# EAGLE design input-device (EAGLE 9.6.2)
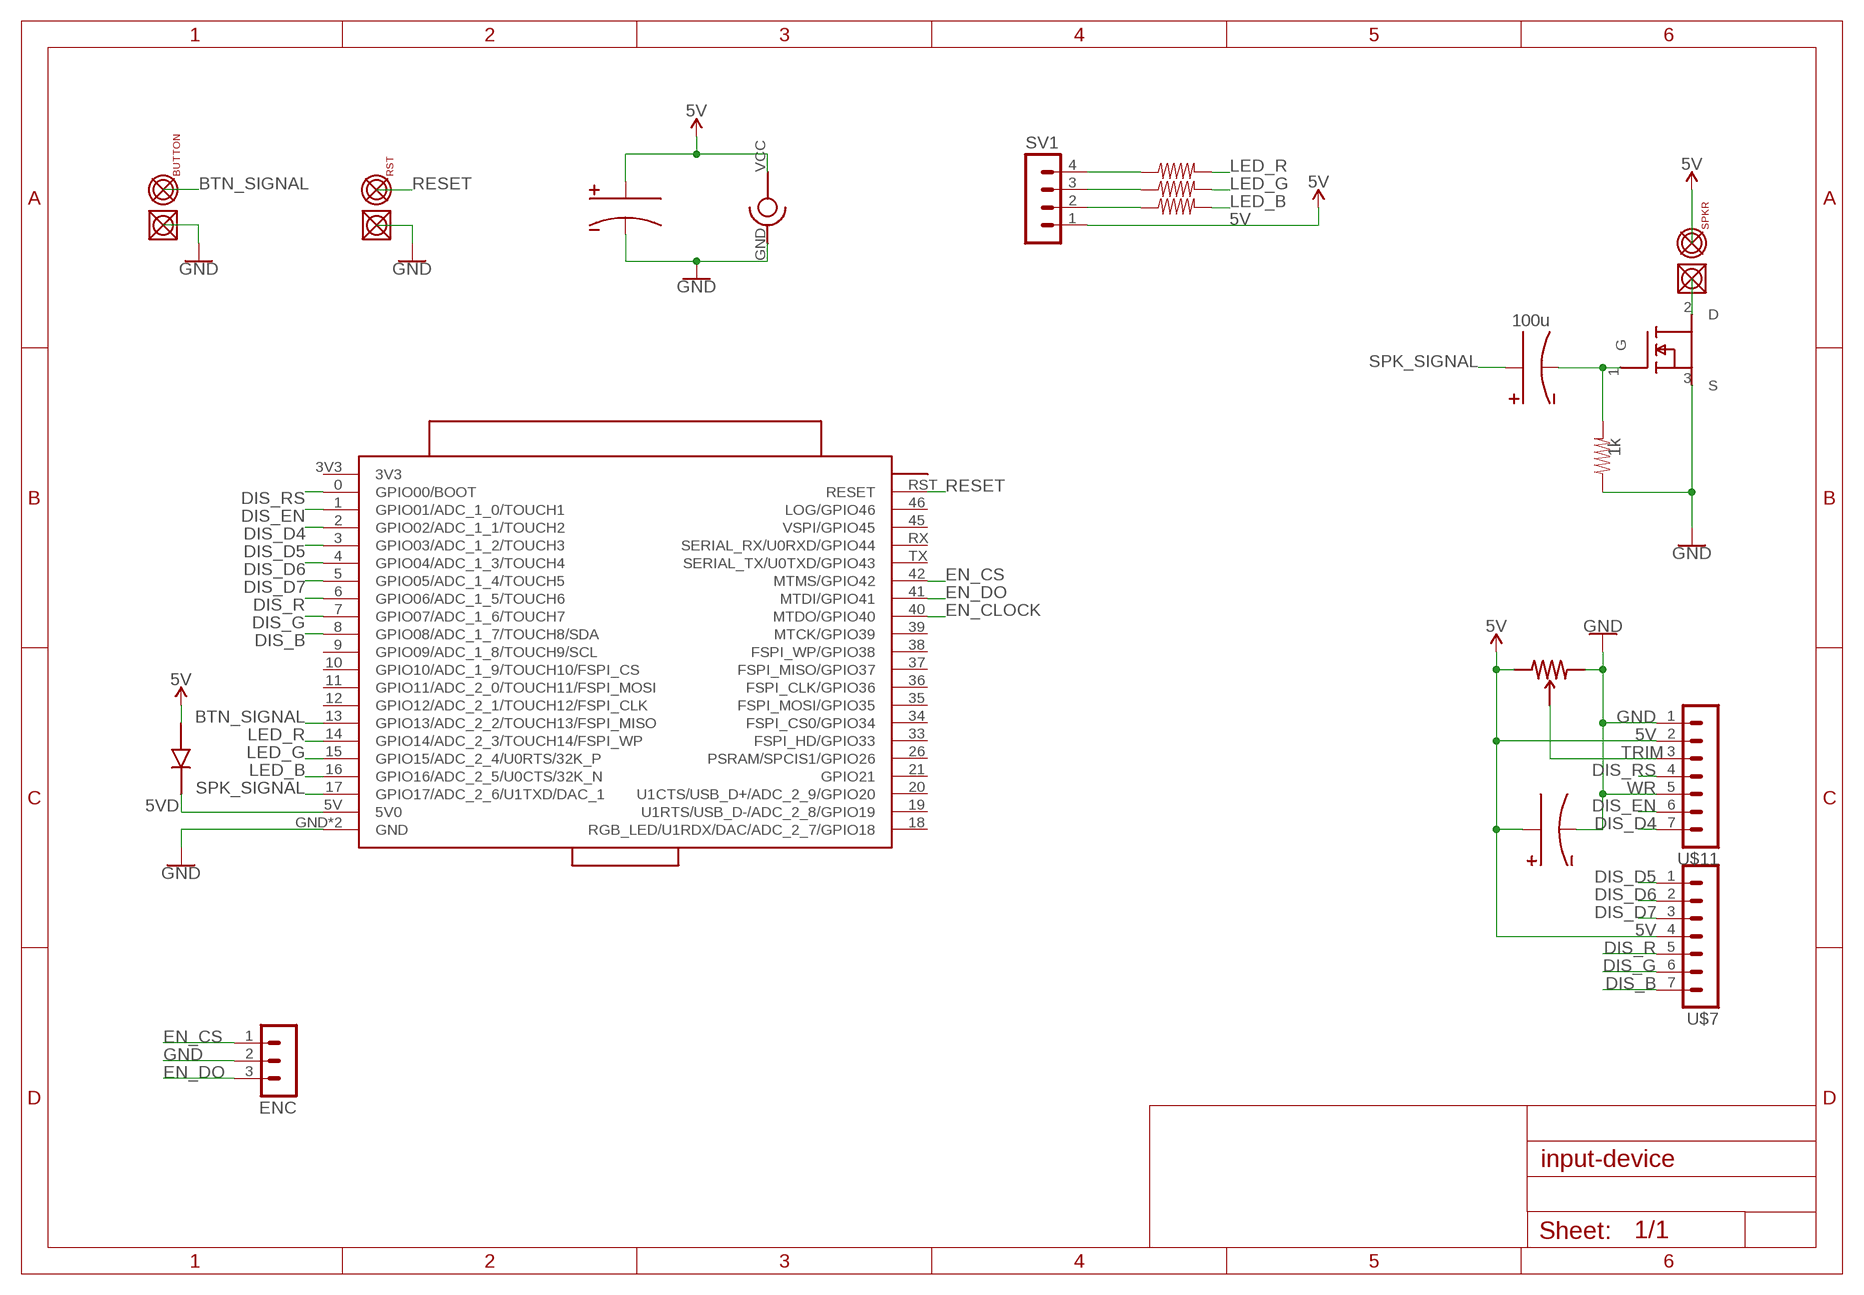
[diagram p0: schematic, sheet 1]

## Parts
BUTTON  PIN-HEADER-02X1GROUND  [02X1-PAD-2.54PITCH-MASK-NAME]
ENC  PIN-HEADER-03X1THRU-254  [MA03-1]
IRL540NPBF  MOSFET-N-IRL540NPBFBENDED-SHORTEST  [TO220AH-SHORTEST-BEND]
R  1k  RESISTOR  [RESISTOR-THRU-1/4]
RST  PIN-HEADER-02X1GROUND  [02X1-PAD-2.54PITCH-MASK-NAME]
SPKR  PIN-HEADER-02X1GROUND  [02X1-PAD-2.54PITCH-MASK-NAME]
SV1  PIN-HEADER-04X01  [MA04-1]
U$1  RESISTOR  [RESISTOR-THRU-1/4]
U$2  POWER-JACK  [JACK-5.5X2.1-THRU]
U$3  ESP32-S2-SAOLA-1  [ESP32-S2-SAOLA-1]
U$4  RESISTOR  [RESISTOR-THRU-1/4]
U$5  100  RESISTOR  [RESISTOR-THRU-1/4]
U$6  CAPACITOR-POLARIZEDCAP-DIAM-8.3MM-H-12MM-BENT  [CAP-DIAM-8.3MM-H-12MM-BENT]
U$7  PIN-HEADER-07X1  [MA07-1]
U$8  DIODE  [DIODE]
U$9  TRIMMER  [TRIMMER-PLASTIC-BLUE-9MM-2,54]
U$11  PIN-HEADER-07X1  [MA07-1]
U$13  CAPACITOR-POLARIZEDCAP-DIAM-8.3MM-H-12MM-BENT  [CAP-DIAM-8.3MM-H-12MM-BENT]
U$14  100u  CAPACITOR-POLARIZEDCAP-DIAM-6.5MM-H11.3MM-BENT-FLIP  [CAP-DIAM-6.5MM-H-11.3MM-BENT-FLIP]

## Nets
5V [wider]: SPKR.1 SV1.1 U$2.VCC U$6.VCC U$7.4 U$8.IN U$9.A U$11.2 U$13.VCC
5VD [wider]: U$3.5V(5V0) U$8.OUT
BTN_SIGNAL: BUTTON.1 U$3.13(GPIO13/ADC_2_2/TOUCH13/FSPI_MISO)
DIS_B: U$3.8(GPIO08/ADC_1_7/TOUCH8/SDA) U$7.7
DIS_D4: U$3.2(GPIO02/ADC_1_1/TOUCH2) U$11.7
DIS_D5: U$3.3(GPIO03/ADC_1_2/TOUCH3) U$7.1
DIS_D6: U$3.4(GPIO04/ADC_1_3/TOUCH4) U$7.2
DIS_D7: U$3.5(GPIO05/ADC_1_4/TOUCH5) U$7.3
DIS_EN: U$3.1(GPIO01/ADC_1_0/TOUCH1) U$11.6
DIS_G: U$3.7(GPIO07/ADC_1_6/TOUCH7) U$7.6
DIS_R: U$3.6(GPIO06/ADC_1_5/TOUCH6) U$7.5
DIS_RS: U$3.0(GPIO00/BOOT) U$11.4
EN_CLOCK: U$3.40(MTDO/GPIO40)
EN_CS: ENC.1 U$3.42(MTMS/GPIO42)
EN_DO: ENC.3 U$3.41(MTDI/GPIO41)
GND: BUTTON.2 ENC.2 IRL540NPBF.3(S) R.1 RST.2 U$2.GND U$3.GND U$3.GND2(GND) U$6.GND U$9.B U$11.1 U$11.5 U$13.GND
LED_B: U$3.16(GPIO16/ADC_2_5/U0CTS/32K_N) U$5.2
LED_B_RES: SV1.2 U$5.1
LED_G: U$3.15(GPIO15/ADC_2_4/U0RTS/32K_P) U$4.2
LED_G_RES: SV1.3 U$4.1
LED_R: U$1.2 U$3.14(GPIO14/ADC_2_3/TOUCH14/FSPI_WP)
LED_R_RES: SV1.4 U$1.1
N$1: IRL540NPBF.1(G) R.2 U$14.GND
RESET: RST.1 U$3.RST(RESET)
SPEAKER-SINK: IRL540NPBF.2(D) SPKR.2
SPK_SIGNAL: U$3.17(GPIO17/ADC_2_6/U1TXD/DAC_1) U$14.VCC
TRIM: U$9.C U$11.3
Unconnected: U$3.3V3 U$3.9(GPIO09/ADC_1_8/TOUCH9/SCL) U$3.10(GPIO10/ADC_1_9/TOUCH10/FSPI_CS) U$3.11(GPIO11/ADC_2_0/TOUCH11/FSPI_MOSI) U$3.12(GPIO12/ADC_2_1/TOUCH12/FSPI_CLK) U$3.18(RGB_LED/U1RDX/DAC/ADC_2_7/GPIO18) U$3.19(U1RTS/USB_D-/ADC_2_8/GPIO19) U$3.20(U1CTS/USB_D+/ADC_2_9/GPIO20) U$3.21(GPIO21) U$3.26(PSRAM/SPCIS1/GPIO26) U$3.33(FSPI_HD/GPIO33) U$3.34(FSPI_CS0/GPIO34) U$3.35(FSPI_MOSI/GPIO35) U$3.36(FSPI_CLK/GPIO36) U$3.37(FSPI_MISO/GPIO37) U$3.38(FSPI_WP/GPIO38) U$3.39(MTCK/GPIO39) U$3.45(VSPI/GPIO45) U$3.46(LOG/GPIO46) U$3.RX(SERIAL_RX/U0RXD/GPIO44) U$3.TX(SERIAL_TX/U0TXD/GPIO43)

## Notes on the sheet
- WR

## Library data of the parts
BUTTON RST SPKR = 00-DDD-CONNECTORS:PIN-HEADER-02X1
ENC = 00-DDD-CONNECTORS:PIN-HEADER-03X1: PIN HEADER; OC_FARNELL: unknown; OC_NEWARK: unknown
IRL540NPBF = 00-DDD-MOSFET:MOSFET-N-IRL540NPBF
R = 00-DDD-Utility-(resistors,caps,etc):RESISTOR; R1: 1k
SV1 = 00-DDD-CONNECTORS:PIN-HEADER-04X01: PIN HEADER; OC_FARNELL: unknown; OC_NEWARK: unknown
U$1 U$4 U$5 = 00-DDD-Utility-(resistors,caps,etc):RESISTOR
U$2 = 00-DDD-POWER-IO:POWER-JACK
U$3 = 00-DDD-ESP32:ESP32-S2-SAOLA-1
U$6 U$13 = 00-DDD-Utility-(resistors,caps,etc):CAPACITOR-POLARIZED
U$7 U$11 = 00-DDD-CONNECTORS:PIN-HEADER-07X1
U$8 = 00-DDD-Utility-(resistors,caps,etc):DIODE
U$9 = 00-DDD-Utility-(resistors,caps,etc):TRIMMER
U$14 = 00-DDD-Utility-(resistors,caps,etc):CAPACITOR-POLARIZED; C1: 100u

## Net classes
0 default: width 0.35 mm, clearance 0.35 mm
1 wider: width 0.6 mm, clearance 0.4 mm

## Board
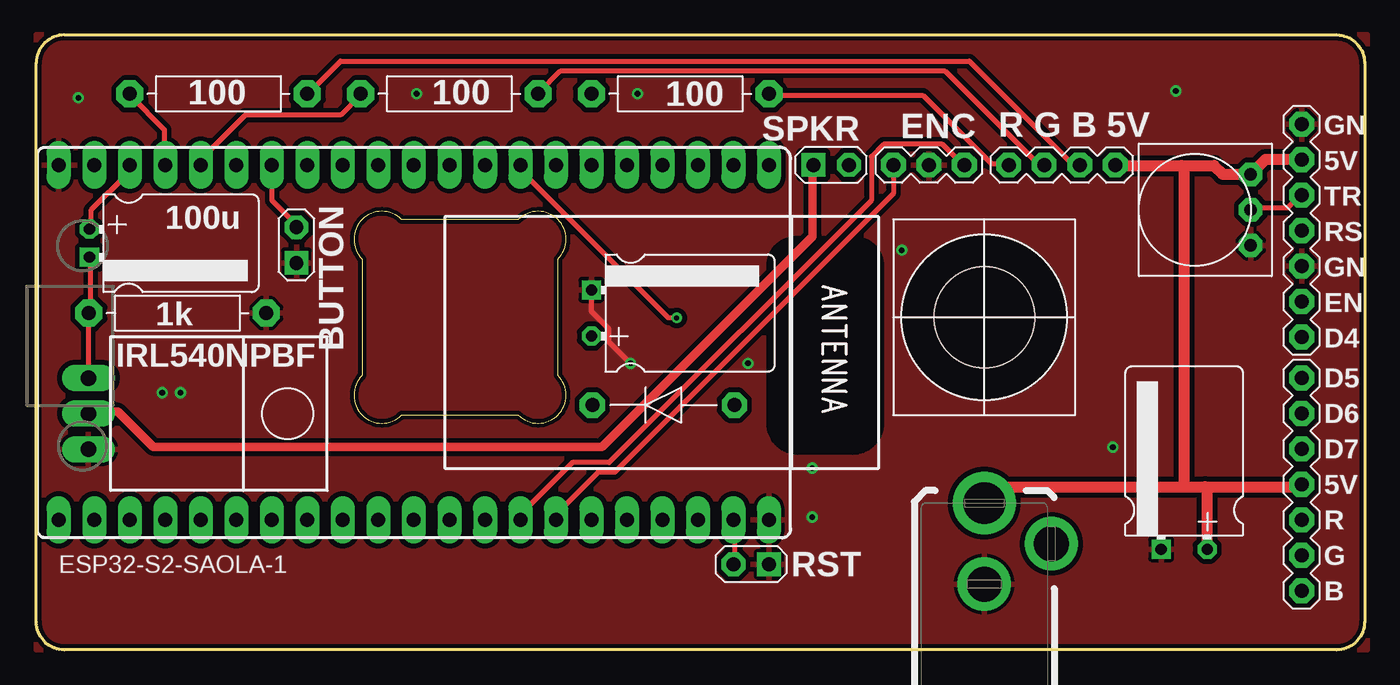
[diagram p1: board, top side]
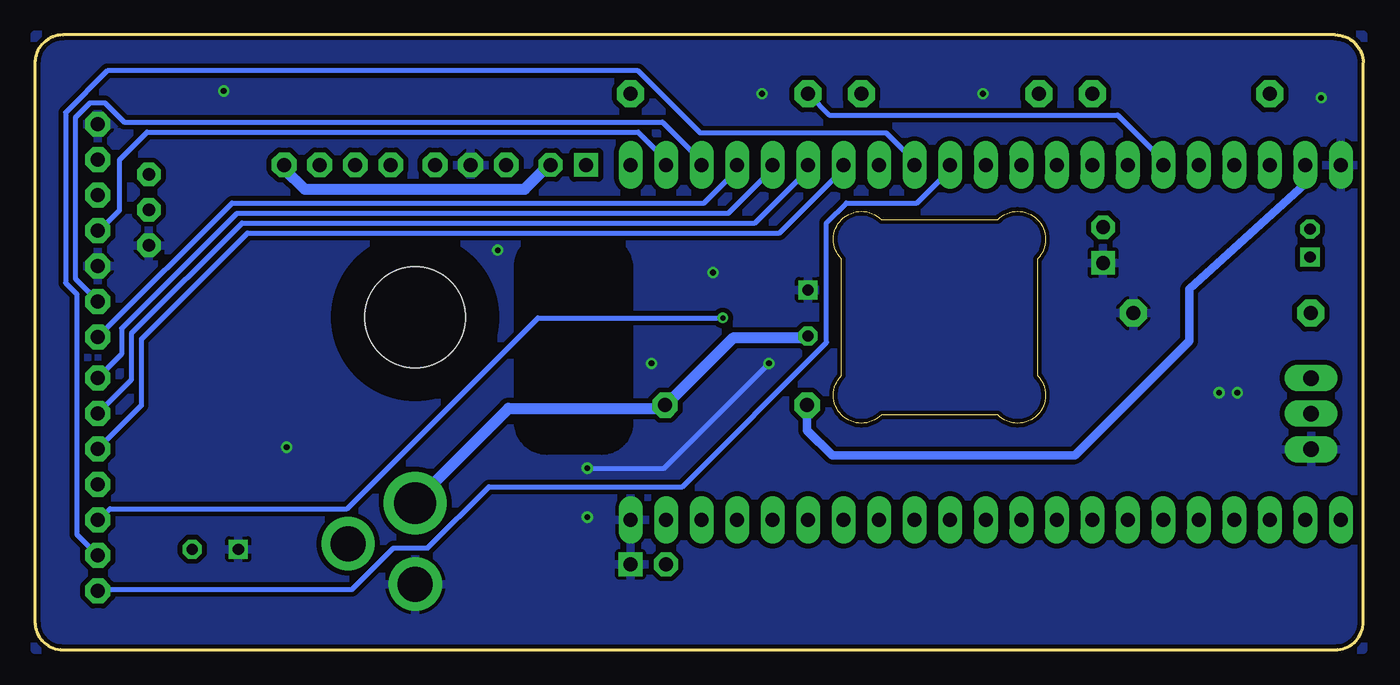
[diagram p2: board, bottom side, seen from below]

Size 95 x 44 mm. Coordinates in mm from the lower left corner, seen from the top.
Outline: 93,0 2,0 arc-90 0,2 0,42 arc-90 2,44 93,44 arc-90 95,42 95,2 arc-90 93,0
Outline: 23.3,19.63 arc180 26.13,16.8 34.47,16.8 arc180 37.3,19.63 37.3,27.97 arc180 34.47,30.8 26.13,30.8 arc180 23.3,27.97 23.3,19.63
Copper layers (1*16): Top 0.035mm / dielectric 1.5mm / Bottom 0.035mm
Design rules "Production": minimum track width 0.35mm, minimum drill 0.35mm, track to track 0.3mm, track to pad 0.3mm, pad to pad 0.3mm, via to via 0.3mm, smd to smd 0.3mm, copper to edge 0.3mm, drill to drill 0.3mm, minimum pad ring 0.2mm, minimum via ring 0.2mm, stop-mask expansion 4mil, vias tented up to drill 0mil, thermal gap 10mil
Holes 7.2 mm at 67.8,23.8
tRestrict: area 63.3,19.3 to 72.3,28.3
bRestrict: area 63.3,19.3 to 72.3,28.3

### Footprints (pad centres in the part's own frame; a part is rotated, then mirrored left to right if it is on the bottom)
02X1-PAD-2.54PITCH-MASK-NAME = drill 1 pad 1.5 octagon: 1 -1.27,0 | drill 1 pad 1.5 square: 2 1.27,0
MA03-1 = drill 1 pad 1.778 octagon: 1 -2.54,0; 2 0,0; 3 2.54,0
TO220AH-SHORTEST-BEND = drill 1.118 long: 1 -2.54,-0.08; 2 0,-0.08; 3 2.54,-0.08
RESISTOR-THRU-1/4 = drill 1 pad 1.93 octagon: 1 -6.35,0; 2 6.35,0
MA04-1 = drill 1 pad 1.778 octagon: 1 -3.81,0; 2 -1.27,0; 3 1.27,0; 4 3.81,0
JACK-5.5X2.1-THRU = drill 2.5 pad 3.81: CONTACT 4.8,10.7; GND 0,7.8 | drill 3 pad 4.5: VCC 0,13.6
ESP32-S2-SAOLA-1 = drill 1 pad 1.2 long: 0 -12.7,22.86; 1 -12.7,20.32; 2 -12.7,17.78; 3 -12.7,15.24; 3V3 -12.7,25.4; 4 -12.7,12.7; 5 -12.7,10.16; 5V -12.7,-22.86; 6 -12.7,7.62; 7 -12.7,5.08; 8 -12.7,2.54; 9 -12.7,0; 10 -12.7,-2.54; 11 -12.7,-5.08; 12 -12.7,-7.62; 13 -12.7,-10.16; 14 -12.7,-12.7; 15 -12.7,-15.24; 16 -12.7,-17.78; 17 -12.7,-20.32; 18 12.7,-25.4; 19 12.7,-22.86; 20 12.7,-20.32; 21 12.7,-17.78; 26 12.7,-15.24; 33 12.7,-12.7; 34 12.7,-10.16; 35 12.7,-7.62; 36 12.7,-5.08; 37 12.7,-2.54; 38 12.7,0; 39 12.7,2.54; 40 12.7,5.08; 41 12.7,7.62; 42 12.7,10.16; 45 12.7,17.78; 46 12.7,20.32; GND -12.7,-25.4; GND2 12.7,25.4; RST 12.7,22.86; RX 12.7,15.24; TX 12.7,12.7
CAP-DIAM-8.3MM-H-12MM-BENT = drill 0.8 square: GND -1.65,0 | drill 0.8 octagon: VCC 1.65,0
MA07-1 = drill 1 pad 1.778 octagon: 1 -7.62,0; 2 -5.08,0; 3 -2.54,0; 4 0,0; 5 2.54,0; 6 5.08,0; 7 7.62,0
DIODE = drill 1 pad 1.8 octagon: IN -5.08,0; OUT 5.08,0
TRIMMER-PLASTIC-BLUE-9MM-2,54 = drill 0.9 pad 1.676 octagon: A -2.54,3.81; B 2.54,3.81; C 0,3.81
CAP-DIAM-6.5MM-H-11.3MM-BENT-FLIP = drill 0.8 square: GND 1,0 | drill 0.8 octagon: VCC -1,0

### Placement (x,y rotation side)
BUTTON  18.6,28.96 270 top
ENC  63.83,34.7 0 top
IRL540NPBF  3.8,16.9 270 top
R  10.1,24.1 180 top
RST  51.13,6.12 0 top
SPKR  56.84,34.7 180 top
SV1  73.35,34.7 180 top
U$1  46.05,39.78 180 top
U$2  67.8,-3.1 0 top
U$3  27,22 270 top
U$4  29.54,39.78 180 top
U$5  13.03,39.78 180 top
U$6  82.1,7.2 0 top
U$7  90.5,11.84 270 top
U$8  44.84,17.51 180 top
U$9  83.05,31.48 270 top
U$11  90.5,30 270 top
U$13  39.7,24.1 270 top
U$14  3.8,29.1 270 top

### Tracks (layer width: path | path; a pad name or v marks a point on that pad's centre or on a via)
5V
  Top 0.8: 82.12,11.68 69,11.68 67.95,10.62 U$2.VCC | 82.12,11.68 83.6,11.68 | 83.6,11.68 90.35,11.68 U$7.4 | 82.12,11.68 82.12,34.45 81.92,34.65 | U$6.VCC 83.75,11.53 83.6,11.68 | 81.92,34.65 84.23,34.65 84.86,34.02 U$9.A 87.91,35.08 U$11.2 | SV1.1 77.22,34.65 81.92,34.65
  Bottom 0.8: SV1.1 77.16,34.41 75.7,32.95 59.97,32.95 58.33,34.6 58.15,34.6 SPKR.1 | U$13.VCC 39.77,22.35 45.02,22.35 49.92,17.45 U$8.IN 50.1,17.27 61.12,17.27 67.78,10.62 U$2.VCC
5VD
  Bottom 0.6: U$8.OUT 39.77,15.71 37.98,13.93 20.62,13.93 12.45,22.1 12.45,25.81 4.14,33.36 U$3.5V
BTN_SIGNAL
  Top 0.35: U$3.13 16.85,34.6 16.85,32.15 18.6,30.4 BUTTON.1
DIS_B
  Bottom 0.35: U$3.8 29.62,34.6 29.62,34.25 31.9,31.98 36.98,31.98 38.38,30.57 38.38,22 48.7,11.68 62.52,11.68 66.9,7.3 69.35,7.3 72.33,4.32 90.35,4.32 U$7.7
DIS_D4
  Bottom 0.35: U$3.2 44.85,34.6 44.85,34.25 47.13,31.97 80.91,31.97 90.35,22.52 U$11.7
DIS_D5
  Bottom 0.35: U$7.1 88.8,21.16 88.8,23 80.55,31.25 45.4,31.25 42.4,34.25 42.4,34.6 U$3.3
DIS_D6
  Bottom 0.35: U$7.2 88.1,19.32 88.1,22.62 80.18,30.54 43.49,30.54 39.77,34.25 39.77,34.6 U$3.4
DIS_D7
  Bottom 0.35: U$7.3 87.4,17.48 87.4,22.23 79.8,29.83 41.74,29.83 37.33,34.25 37.33,34.6 U$3.5
DIS_EN
  Bottom 0.35: U$3.1 47.48,34.77 47.48,35.12 50.12,37.77 88.62,37.77 90,39.15 91.05,39.15 92.1,38.1 92.1,26.55 90.53,24.98 U$11.6
DIS_G
  Bottom 0.35: U$7.6 92,8.26 92,25.45 92.8,26.25 92.8,38.45 89.83,41.42 51.85,41.42 47.4,36.98 34.1,36.98 32.25,35.12 32.25,34.77 U$3.7
DIS_R  (via drill 0.35)
  Top 0.35: U$3.6 34.62,34.33 45.2,23.75 v45.8,23.75
  Bottom 0.35: v45.8,23.75 59.02,23.75 72.67,10.1 89.65,10.1 90.35,9.4 U$7.5
DIS_RS
  Bottom 0.35: U$3.0 49.92,34.77 49.92,35.12 51.85,37.05 86.97,37.05 88.95,35.08 88.95,31.45 90.35,30.05 U$11.4
EN_CS
  Top 0.35: ENC.1 61.29,32.63 41.36,12.7 40.16,12.7 37.16,9.7 U$3.42
EN_DO
  Top 0.35: U$3.41 34.7,9.4 34.7,9.75 38.35,13.4 40.98,13.4 59.73,32.15 59.73,35.3 60.6,36.17 64.8,36.17 66.2,34.77 ENC.3
GND  (via drill 0.4)
  Top 0.35: v42.5,20.5 40.95,22.05 40.95,22.97 39.7,24.23 U$13.GND
  Bottom 0.35: v55.5,13 50,13 v42.5,20.5
  other vias: 55.5,9.5 9,18.4 77,14.5 3,39.5 27.2,39.8 43,39.8 46.5,27 81.5,40 61.9,28.6 50.9,20.5 10.3,18.4
  pour Bottom: 95,0 0,0 0,44 95,44
  pour Top: 0,44 0,0 95.2,0 95.2,44
LED_B
  Top 0.35: U$3.16 9.15,34.77 9.15,37.23 6.7,39.67 U$5.2
LED_B_RES
  Top 0.35: SV1.2 74.6,34.77 74.08,34.77 66.72,42.12 21.75,42.12 19.48,39.85 U$5.1
LED_G
  Top 0.35: U$3.15 11.78,34.77 11.78,35.12 14.93,38.27 21.75,38.27 23.15,39.67 U$4.2
LED_G_RES
  Top 0.35: SV1.3 71.97,34.77 71.62,34.77 64.97,41.42 37.5,41.42 35.92,39.85 U$4.1
LED_R
  Bottom 0.35: U$3.14 14.4,34.77 14.4,35.12 17.55,38.27 38.2,38.27 39.6,39.67 U$1.2
LED_R_RES
  Top 0.35: SV1.4 69.53,34.77 68.3,34.77 63.4,39.67 52.55,39.67 U$1.1
N$1
  Top 0.35: U$14.GND 3.9,27.95 3.9,24.1 R.2 3.73,24.1 3.73,19.55 IRL540NPBF.1
N$3
  cutout Top: 60.55,27.49 60.55,16.18 arc-90 58.39,14.02 54.47,14.02 arc-90 52.3,16.18 52.3,27.49 arc-90 54.38,29.57 58.47,29.57 arc-90
N$4
  cutout Bottom: 58.49,29.62 54.57,29.62 arc90 52.3,27.35 52.3,16.18 arc90 54.47,14.02 58.39,14.02 arc90 60.66,16.28 60.66,27.45 arc90
RESET
  Top 0.35: RST.1 49.92,6.25 49.92,9.22 U$3.RST
SPEAKER-SINK
  Top 0.6: IRL540NPBF.2 3.87,17.05 5.82,17.05 8.35,14.53 40.47,14.53 55.52,29.58 55.52,34.65 SPKR.2
SPK_SIGNAL
  Top 0.35: U$14.VCC 3.9,30.23 3.9,31.45 6.52,34.08 6.52,34.6 U$3.17
TRIM
  Top 0.35: U$9.C 87.03,31.62 89.47,31.62 90.35,32.5 U$11.3

### Text on the board
tPlace: 100 | 100 | 100 | GN | ENC | R G B 5V | 5V | TR | RS | GN | EN | D4 | D5 | D6 | D7 | 5V | R | G | B